# EAGLE design adc (EAGLE 9.6.2)
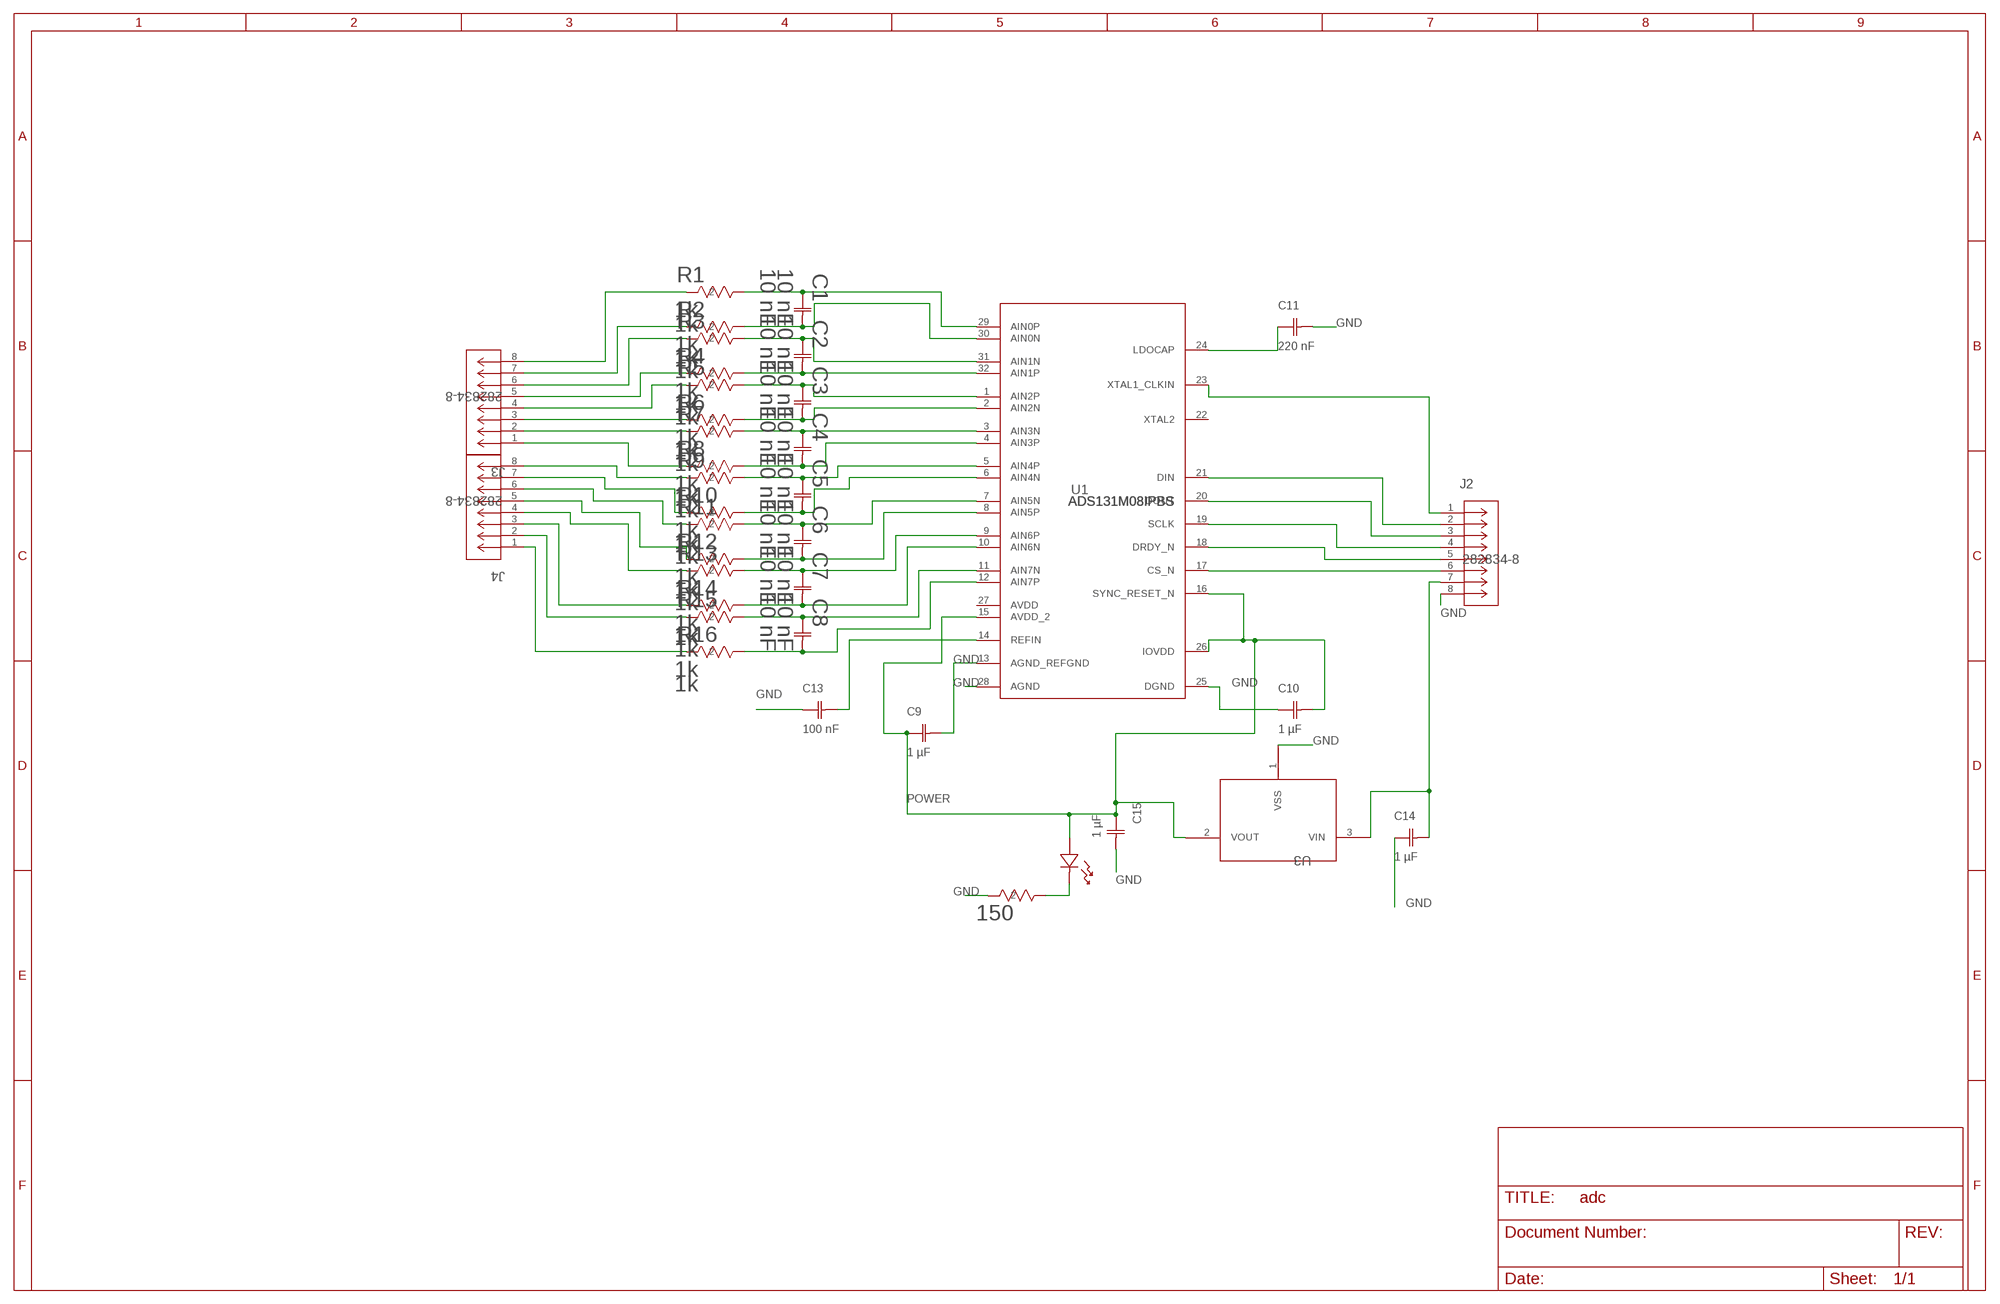
[diagram p0: schematic, sheet 1]

## Parts
C1  10 nF  C0805C103K5RACAUTO  [CAPC220145_88N_KEM]
C2  10 nF  C0805C103K5RACAUTO  [CAPC220145_88N_KEM]
C3  10 nF  C0805C103K5RACAUTO  [CAPC220145_88N_KEM]
C4  10 nF  C0805C103K5RACAUTO  [CAPC220145_88N_KEM]
C5  10 nF  C0805C103K5RACAUTO  [CAPC220145_88N_KEM]
C6  10 nF  C0805C103K5RACAUTO  [CAPC220145_88N_KEM]
C7  10 nF  C0805C103K5RACAUTO  [CAPC220145_88N_KEM]
C8  10 nF  C0805C103K5RACAUTO  [CAPC220145_88N_KEM]
C9  1 µF  C0805C105K5RACTU  [CAPC220145_140N_KEM]
C10  1 µF  C0805C105K5RACTU  [CAPC220145_140N_KEM]
C11  220 nF  C0805C224K5RACAUTO  [CAPC220145_100N_KEM]
C13  100 nF  C0805C104K5RACTU  [CAPC220145_88N_KEM]
C14  1 µF  C0805C105K5RACTU  [CAPC220145_140N_KEM]
C15  1 µF  C0805C105K5RACTU  [CAPC220145_140N_KEM]
J2  282834-8  [CONN_282834-8_TEC]
J3  282834-8  [CONN_282834-8_TEC]
J4  282834-8  [CONN_282834-8_TEC]
LED1  LTST-C190KFKT  [LED_LSTS-C190_LTO]
R1  1k  RC0402JR-071KLRC0402N_YAG-M  [RC0402N_YAG-M]
R2  1k  RC0402JR-071KLRC0402N_YAG-M  [RC0402N_YAG-M]
R3  1k  RC0402JR-071KLRC0402N_YAG-M  [RC0402N_YAG-M]
R4  1k  RC0402JR-071KLRC0402N_YAG-M  [RC0402N_YAG-M]
R5  1k  RC0402JR-071KLRC0402N_YAG-M  [RC0402N_YAG-M]
R6  1k  RC0402JR-071KLRC0402N_YAG-M  [RC0402N_YAG-M]
R7  1k  RC0402JR-071KLRC0402N_YAG-M  [RC0402N_YAG-M]
R8  1k  RC0402JR-071KLRC0402N_YAG-M  [RC0402N_YAG-M]
R9  1k  RC0402JR-071KLRC0402N_YAG-M  [RC0402N_YAG-M]
R10  1k  RC0402JR-071KLRC0402N_YAG-M  [RC0402N_YAG-M]
R11  1k  RC0402JR-071KLRC0402N_YAG-M  [RC0402N_YAG-M]
R12  1k  RC0402JR-071KLRC0402N_YAG-M  [RC0402N_YAG-M]
R13  1k  RC0402JR-071KLRC0402N_YAG-M  [RC0402N_YAG-M]
R14  1k  RC0402JR-071KLRC0402N_YAG-M  [RC0402N_YAG-M]
R15  1k  RC0402JR-071KLRC0402N_YAG-M  [RC0402N_YAG-M]
R16  1k  RC0402JR-071KLRC0402N_YAG-M  [RC0402N_YAG-M]
R18  150  RC0402JR-07150RLRC0402N_YAG-M  [RC0402N_YAG-M]
U1  ADS131M08IPBS  [PBS0032A_N]
U3  XC6206P332MR-GSOT-23_TOR-L  [SOT-23_TOR-L]

## Nets
GND: C9.2 C10.1 C11.2 C13.1 C14.1 C15.2 J2.8 R18.2 U1.13(AGND_REFGND) U1.25(DGND) U1.28(AGND) U3.1(VSS)
N$1: C1.1 R1.1 U1.29(AIN0P)
N$2: C1.2 R2.1 U1.30(AIN0N)
N$3: C2.1 R3.1 U1.31(AIN1N)
N$4: C2.2 R4.1 U1.32(AIN1P)
N$5: C3.1 R5.1 U1.1(AIN2P)
N$6: C3.2 R6.1 U1.2(AIN2N)
N$7: C4.1 R7.1 U1.3(AIN3N)
N$8: C4.2 R8.1 U1.4(AIN3P)
N$9: C5.1 R9.1 U1.5(AIN4P)
N$10: C5.2 R10.1 U1.6(AIN4N)
N$11: C6.1 R11.1 U1.7(AIN5N)
N$12: C6.2 R12.1 U1.8(AIN5P)
N$13: C7.1 R13.1 U1.9(AIN6P)
N$14: C7.2 R14.1 U1.10(AIN6N)
N$15: C8.1 R15.1 U1.11(AIN7N)
N$16: C8.2 R16.1 U1.12(AIN7P)
N$17: C11.1 U1.24(LDOCAP)
N$18: J2.1 U1.23(XTAL1_CLKIN)
N$20: J3.8 R1.2
N$21: J3.7 R2.2
N$22: J3.6 R3.2
N$23: J3.5 R4.2
N$24: J3.4 R5.2
N$25: J3.3 R6.2
N$26: J3.2 R7.2
N$27: J3.1 R8.2
N$28: J4.8 R9.2
N$29: J4.7 R10.2
N$30: J4.6 R11.2
N$31: J4.5 R12.2
N$32: J4.4 R13.2
N$33: J4.3 R14.2
N$34: J4.2 R15.2
N$35: J4.1 R16.2
N$36: J2.4 U1.19(SCLK)
N$37: J2.6 U1.17(CS_N)
N$38: J2.5 U1.18(DRDY_N)
N$39: J2.3 U1.20(DOUT)
N$40: J2.2 U1.21(DIN)
N$41: C13.2 U1.14(REFIN)
N$46: LED1.1(CATHODE) R18.1
N$52: C14.2 J2.7 U3.3(VIN)
POWER: C9.1 C10.2 C15.1 LED1.2(ANODE) U1.15(AVDD_2) U1.16(SYNC_RESET_N) U1.26(IOVDD) U3.2(VOUT)
Unconnected: U1.22(XTAL2)

## Power pins joined to a net without a drawn wire
AVDD: U1.27(AVDD)

## Library data of the parts
C1-C8 = C3225X7R1N106M250AC:C0805C103K5RACAUTO; COPYRIGHT: Copyright (C) 2025 Ultra Librarian. All rights reserved.; MANUFACTURER_PART_NUMBER: C0805C103K5RACAUTO; MFR_NAME: Kemet
C9 C10 C14 C15 = C3225X7R1N106M250AC:C0805C105K5RACTU; COPYRIGHT: Copyright (C) 2025 Ultra Librarian. All rights reserved.; MANUFACTURER_PART_NUMBER: C0805C105K5RACTU; MFR_NAME: Kemet
C11 = C3225X7R1N106M250AC:C0805C224K5RACAUTO; COPYRIGHT: Copyright (C) 2025 Ultra Librarian. All rights reserved.; MANUFACTURER_PART_NUMBER: C0805C224K5RACAUTO; MFR_NAME: Kemet
C13 = C3225X7R1N106M250AC:C0805C104K5RACTU; COPYRIGHT: Copyright (C) 2025 Ultra Librarian. All rights reserved.; MANUFACTURER_PART_NUMBER: C0805C104K5RACTU; MFR_NAME: Kemet
J2-J4 = burakkbaltaa:282834-8; COPYRIGHT: Copyright (C) 2025 Ultra Librarian. All rights reserved.; MANUFACTURER_PART_NUMBER: 282834-8; MFR_NAME: TE Connectivity
LED1 = burakkbaltaa:LTST-C190KFKT; COPYRIGHT: Copyright (C) 2025 Ultra Librarian. All rights reserved.; MANUFACTURER_PART_NUMBER: LTST-C190KFKT; MFR_NAME: LITE-ON; TYPE: LED Indication
R1-R16 = burakkbaltaa:RC0402JR-071KL; COPYRIGHT: Copyright (C) 2025 Ultra Librarian. All rights reserved.; MANUFACTURER_PART_NUMBER: RC0402JR-071KL; MFR_NAME: Yageo
R18 = burakkbaltaa:RC0402JR-07150RL; COPYRIGHT: Copyright (C) 2025 Ultra Librarian. All rights reserved.; MANUFACTURER_PART_NUMBER: RC0402JR-07150RL; MFR_NAME: Yageo
U1 = burakkbaltaa:ADS131M08IPBS; COPYRIGHT: Copyright (C) 2025 Ultra Librarian. All rights reserved.; MANUFACTURER_PART_NUMBER: ADS131M08IPBS; MFR_NAME: Texas Instruments; REFDES: RefDes; TYPE: TYPE
U3 = burakkbaltaa:XC6206P332MR-G; COPYRIGHT: Copyright (C) 2025 Ultra Librarian. All rights reserved.; MANUFACTURER_PART_NUMBER: XC6206P332MR-G; MFR_NAME: Torex Semiconductor

## Board
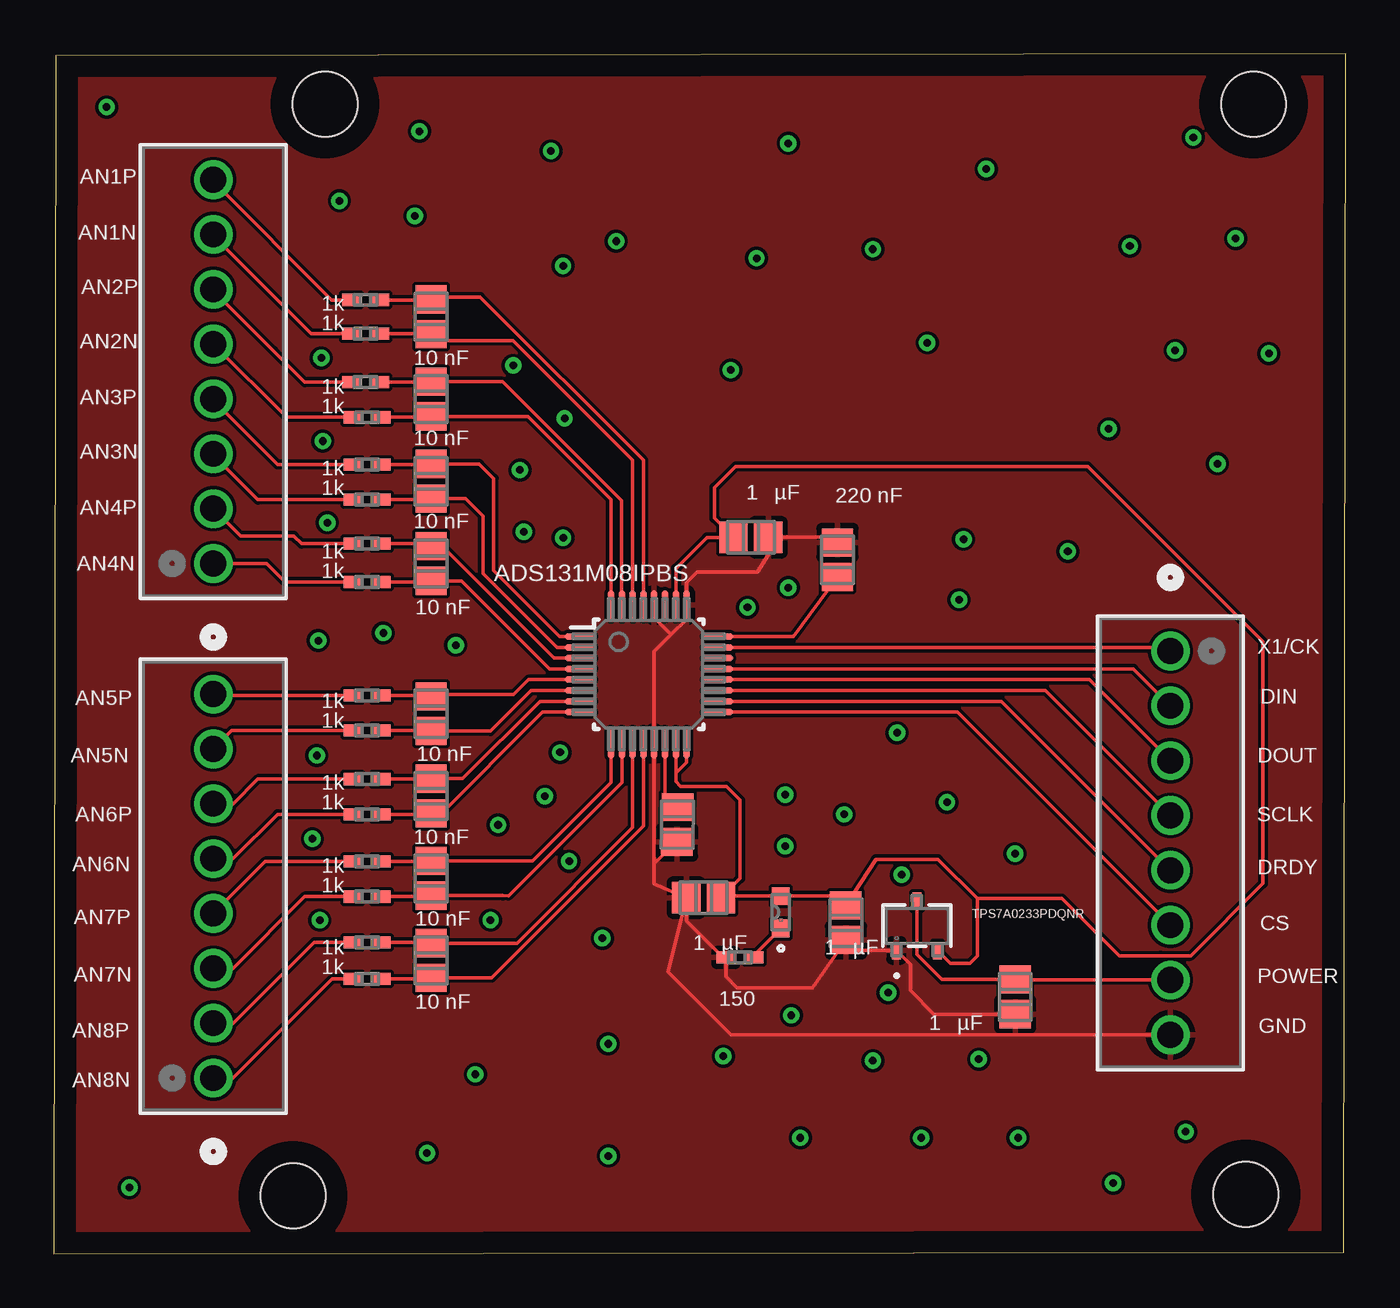
[diagram p1: board, top side]
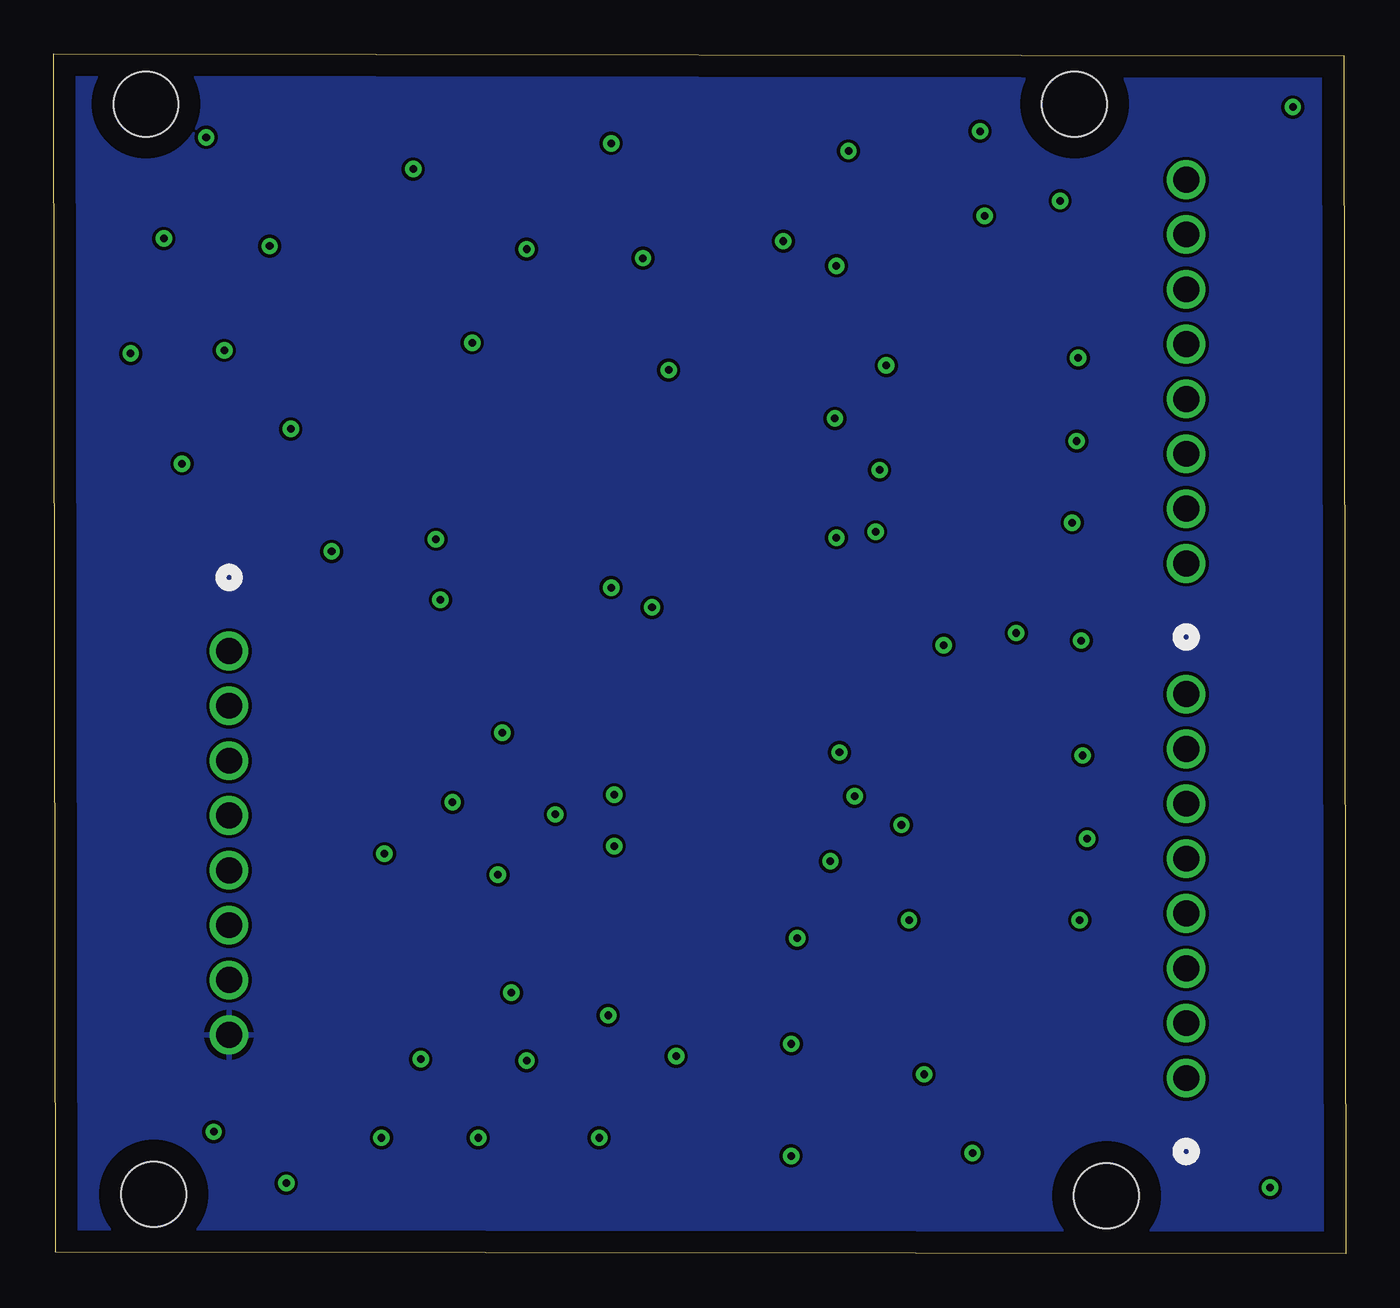
[diagram p2: board, bottom side, seen from below]

Size 59.82 x 55.57 mm. Coordinates in mm from the lower left corner, seen from the top.
Outline: 0,0 59.75,0.07 59.82,55.57 0.07,55.5 0,0
Copper layers (1*16): Top 0.035mm / dielectric 1.5mm / Bottom 0.035mm
Design rules "default *": minimum track width 6mil, minimum drill 0.35mm, track to track 6mil, track to pad 6mil, pad to pad 6mil, via to via 6mil, smd to smd 6mil, copper to edge 40mil, drill to drill 6mil, minimum pad ring 10mil, minimum via ring 8mil, stop-mask expansion 4mil, vias tented up to drill 0mil, thermal gap 10mil
Holes 3 mm at 55.56,53.25 55.2,2.75 12.55,53.25 11.07,2.68

### Footprints (pad centres in the part's own frame; a part is rotated, then mirrored left to right if it is on the bottom)
CAPC220145_88N_KEM = smd 1.306 x 1.45: 1 -0.803,0; 2 0.803,0
CAPC220145_140N_KEM = smd 1.306 x 1.45: 1 -0.803,0; 2 0.803,0
CAPC220145_100N_KEM = smd 1.306 x 1.45: 1 -0.803,0; 2 0.803,0
CONN_282834-8_TEC = drill 1.194 pad 1.702: 1 0,0; 2 2.54,0; 3 5.08,0; 4 7.62,0; 5 10.16,0; 6 12.7,0; 7 15.24,0; 8 17.78,0
LED_LSTS-C190_LTO = smd 0.813 x 0.813: 1 -0.75,0; 2 0.75,0
RC0402N_YAG-M = smd 0.864 x 0.559: 1 -0.66,0; 2 0.66,0
PBS0032A_N = smd 1.4 x 0.3: 1 -3.2,1.75; 2 -3.2,1.25; 3 -3.2,0.75; 4 -3.2,0.25; 5 -3.2,-0.25; 6 -3.2,-0.75; 7 -3.2,-1.25; 8 -3.2,-1.75; 17 3.2,-1.75; 18 3.2,-1.25; 19 3.2,-0.75; 20 3.2,-0.25; 21 3.2,0.25; 22 3.2,0.75; 23 3.2,1.25; 24 3.2,1.75 | smd 0.3 x 1.4: 9 -1.75,-3.2; 10 -1.25,-3.2; 11 -0.75,-3.2; 12 -0.25,-3.2; 13 0.25,-3.2; 14 0.75,-3.2; 15 1.25,-3.2; 16 1.75,-3.2; 25 1.75,3.2; 26 1.25,3.2; 27 0.75,3.2; 28 0.25,3.2; 29 -0.25,3.2; 30 -0.75,3.2; 31 -1.25,3.2; 32 -1.75,3.2
SOT-23_TOR-L = smd 0.432 x 0.813: 1 -0.95,-1.143; 2 0.95,-1.143; 3 0,1.143

### Placement (x,y rotation side)
C1  17.47,43.4 270 top
C2  17.47,39.59 270 top
C3  17.47,35.78 270 top
C4  17.47,31.97 270 top
C5  17.47,25.01 270 top
C6  17.47,21.2 270 top
C7  17.47,17.39 270 top
C8  17.47,13.58 270 top
C9  30.09,16.49 180 top
C10  32.28,33.18 180 top
C11  36.29,32.14 90 top
C13  28.87,19.88 89.3 top
C14  44.52,11.9 90 top
C15  36.68,15.33 270.3 top
J2  51.71,27.92 270 top
J3  7.38,31.97 90 top
J4  7.38,8.14 90 top
LED1  33.67,15.82 90 top
R1  14.43,44.18 180 top
R2  14.43,42.62 180 top
R3  14.43,40.37 180 top
R4  14.5,38.74 180 top
R5  14.5,36.56 180 top
R6  14.5,34.93 180 top
R7  14.5,32.89 180 top
R8  14.5,31.12 180 top
R9  14.5,25.86 180 top
R10  14.5,24.23 180 top
R11  14.5,21.98 180 top
R12  14.5,20.35 180 top
R13  14.5,18.17 180 top
R14  14.5,16.54 180 top
R15  14.5,14.43 180 top
R16  14.5,12.73 180 top
R18  31.78,13.72 180 top
U1  27.55,26.84 0 top
U3  39.97,15.19 0 top

### Tracks (layer width: path | path; a pad name or v marks a point on that pad's centre or on a via)
GND
  Top 0.152: U1.28 27.85,29.99 27.85,29.4 28.58,28.67 | 28.58,28.67 29.29,29.38 29.3,29.38 U1.25 29.3,31.08 29.79,31.57 32.58,31.57 33.08,32.4 C10.1 33.93,33.2 36.26,33.2 C11.2 | 28.58,28.67 27.8,27.89 U1.13 27.8,18.08 | 27.8,18.08 27.8,17.13 C9.2 | C9.2 28.44,13.05 31.35,10.14 J2.8 | C13.1 27.8,18.08 | 36.69,14.05 C15.2 | C15.2 35.14,12.32 31.64,12.32 31.12,12.84 31.12,13.58 | 31.12,13.58 R18.2 | C15.2 37.06,14.05 U3.1 39.67,13.4 39.67,12.19 40.76,11.1 C14.1 | C9.2 29.29,15.41 31.12,13.58
  pour Top: 59.63,55.37 0.18,55.37 0.18,0.14 59.63,0.14
  pour Bottom: 0.2,55.37 0.2,0.13 59.66,0.13 59.66,55.37
N$1
  Top 0.152: C1.1 17.47,44.31 19.74,44.31 27.3,36.75 U1.29 | C1.1 17.47,44.14 | C1.1 17.45,44.18 R1.1
N$2
  Top 0.152: C1.2 17.4,42.3 21.26,42.3 26.8,36.76 U1.30 | C1.2 17.47,42.4 | C1.2 17.45,42.62 R2.1
N$3
  Top 0.152: U1.31 26.28,30.06 26.28,34.89 20.78,40.39 C2.1 17.45,40.37 R3.1
N$4
  Top 0.152: U1.32 25.8,34.94 21.96,38.78 C2.2 17.42,38.74 R4.1
N$5
  Top 0.152: U1.1 23.42,28.59 20.37,31.64 20.37,35.91 19.7,36.58 C3.1 17.45,36.56 R5.1
N$6
  Top 0.152: C3.2 17.48,34.77 | U1.2 23.29,28.09 19.88,31.5 19.88,34.16 19.06,34.98 C3.2 | C3.2 17.16,34.93 R6.1
N$7
  Top 0.152: C4.1 17.68,32.9 | U1.3 23.16,27.59 17.98,32.77 C4.1 | R7.1 17.35,32.89 C4.1
N$8
  Top 0.152: U1.4 23.17,27.09 | 23.17,27.09 | 23.17,27.09 22.96,27.09 18.88,31.17 C4.2 17.42,31.12 R8.1
N$9
  Top 0.152: U1.5 21.97,26.59 21.28,25.9 17.61,25.9 C5.1 17.13,25.86 R9.1
N$10
  Top 0.152: U1.6 22.1,26.09 20.22,24.21 C5.2 17.45,24.23 R10.1
N$11
  Top 0.152: 24.33,25.57 U1.7 22.51,25.59 18.92,22 C6.1 17.45,21.98 R11.1
N$12
  Top 0.152: U1.8 22.64,25.09 17.72,20.17 C6.2 17.42,20.35 R12.1
N$13
  Top 0.152: 17.83,18.19 C7.1 | U1.9 25.8,21.83 22.16,18.19 C7.1 | C7.1 17.45,18.17 R13.1
N$14
  Top 0.152: U1.10 26.3,21.83 21.05,16.58 20.78,16.59 C7.2 17.42,16.54 R14.1
N$15
  Top 0.152: U1.11 26.8,19.74 21.44,14.38 C8.1 | 17.62,14.38 C8.1 | C8.1 17.09,14.43 R15.1
N$16
  Top 0.152: U1.12 27.3,19.81 20.27,12.78 C8.2 | 17.77,12.78 C8.2 | R16.1 17.42,12.73 C8.2
N$17
  Top 0.152: U1.24 34.25,28.59 C11.1
N$18
  Top 0.152: U1.23 51.54,28.09 J2.1
N$19  (via drill 0.35)
  other vias: 22.74,21.19
N$20
  Top 0.152: R1.2 12.87,44.18 7.38,49.67 J3.8
N$21
  Top 0.152: R2.2 11.91,42.62 7.38,47.15 J3.7
N$22
  Top 0.152: R3.2 11.61,40.37 10.15,41.83 10.15,41.84 7.38,44.61 J3.6
N$23
  Top 0.152: R4.2 10.77,38.74 J3.5
N$24
  Top 0.152: R5.2 10.35,36.56 7.38,39.53 J3.4
N$25
  Top 0.152: R6.2 9.44,34.93 7.38,36.99 J3.3
N$26
  Top 0.152: R7.2 11.47,32.89 11.11,33.25 8.64,33.25 J3.2
N$27
  Top 0.152: R8.2 10.7,31.12 9.85,31.97 J3.1
N$28
  Top 0.152: R9.2 7.44,25.86 J4.8
N$29
  Top 0.152: R10.2 8.23,24.23 J4.7
N$30
  Top 0.152: R11.2 9.44,21.98 8.3,20.84 J4.6
N$31
  Top 0.152: R12.2 10.35,20.35 8.3,18.3 J4.5
N$32
  Top 0.152: R13.2 9.79,18.17 J4.4
N$33
  Top 0.152: R14.2 11.62,16.54 8.3,13.22 J4.3
N$34
  Top 0.152: R15.2 12.05,14.43 8.3,10.68 J4.2
N$35
  Top 0.152: R16.2 12.89,12.73 8.3,8.14 J4.1
N$36
  Top 0.152: U1.19 45.92,26.09 J2.4
N$37
  Top 0.152: U1.17 41.84,25.09 J2.6
N$38
  Top 0.152: U1.18 43.88,25.59 J2.5
N$39
  Top 0.152: J2.3 47.96,26.59 U1.20
N$40
  Top 0.152: U1.21 50,27.09 J2.2
N$41
  Top 0.152: C13.2 28.3,21.19 U1.14
N$42  (via drill 0.35)
  other vias: 39.26,17.55
N$43  (via drill 0.35)
  other vias: 26.04,46.9
N$44  (via drill 0.35)
  other vias: 37.93,46.53
N$45  (via drill 0.35)
  other vias: 25.67,9.72
N$46
  Top 0.152: 32.47,13.75 R18.1 32.44,13.84 LED1.1
N$47  (via drill 0.35)
  other vias: 21.58,36.3
N$48  (via drill 0.35)
  other vias: 36.6,20.35
N$49  (via drill 0.35)
  other vias: 12.17,23.08
N$50  (via drill 0.35)
  other vias: 11.97,19.22
N$51  (via drill 0.35)
  other vias: 44.51,18.53
N$52
  Top 0.152: 44.25,12.53 C14.2 | U3.3 39.97,13.86 41.13,12.7 C14.2 | J2.7 44.57,12.68 C14.2
N$53  (via drill 0.35)
  other vias: 49.83,46.67
N$54  (via drill 0.35)
  other vias: 34.57,5.37
N$55  (via drill 0.35)
  other vias: 17.28,4.67
N$56  (via drill 0.35)
  other vias: 49.06,3.27
N$57  (via drill 0.35)
  other vias: 48.85,38.2
N$58  (via drill 0.35)
  other vias: 41.36,20.91
N$59  (via drill 0.35)
  other vias: 38.63,12.09
N$60  (via drill 0.35)
  other vias: 37.93,8.94
N$61  (via drill 0.35)
  other vias: 42.83,9.01
N$62  (via drill 0.35)
  other vias: 31.35,40.93
N$63  (via drill 0.35)
  other vias: 42.13,33.09
N$64  (via drill 0.35)
  other vias: 16.72,48.07
N$65  (via drill 0.35)
  other vias: 56.27,41.7
N$66  (via drill 0.35)
  other vias: 39.05,24.13
N$67  (via drill 0.35)
  other vias: 12.31,15.45
N$70  (via drill 0.35)
  other vias: 25.68,4.53
N$71  (via drill 0.35)
  other vias: 40.45,42.19
N$72  (via drill 0.35)
  other vias: 15.25,28.75
N$73  (via drill 0.35)
  other vias: 23.58,33.16
N$74  (via drill 0.35)
  other vias: 19.52,8.31
N$76  (via drill 0.35)
  other vias: 43.18,50.24
N$79  (via drill 0.35)
  other vias: 44.65,5.37
N$80  (via drill 0.35)
  other vias: 40.17,5.37
N$81  (via drill 0.35)
  other vias: 34.15,11.04
N$82  (via drill 0.35)
  other vias: 31,9.15
N$83  (via drill 0.35)
  other vias: 32.54,46.11
N$84  (via drill 0.35)
  other vias: 23.02,51.08
N$85  (via drill 0.35)
  other vias: 34.01,51.43
N$86  (via drill 0.35)
  other vias: 52.77,51.71
N$87  (via drill 0.35)
  other vias: 54.73,47.02
N$88  (via drill 0.35)
  other vias: 51.93,41.84
N$89  (via drill 0.35)
  other vias: 53.89,36.59
N$90  (via drill 0.35)
  other vias: 46.96,32.53
N$91  (via drill 0.35)
  other vias: 41.92,30.29
N$92  (via drill 0.35)
  other vias: 25.4,14.61
N$93  (via drill 0.35)
  other vias: 20.57,19.86
N$94  (via drill 0.35)
  other vias: 23.44,23.22
N$95  (via drill 0.35)
  other vias: 12.24,28.4
N$96  (via drill 0.35)
  other vias: 18.61,28.19
N$97  (via drill 0.35)
  other vias: 21.76,33.44
N$100  (via drill 0.35)
  other vias: 2.44,53.11
N$102  (via drill 0.35)
  other vias: 3.49,3.06
N$103  (via drill 0.35)
  other vias: 12.66,33.86
N$104  (via drill 0.35)
  other vias: 12.45,37.64
N$105  (via drill 0.35)
  other vias: 12.38,41.49
N$106  (via drill 0.35)
  other vias: 13.22,48.77
N$107  (via drill 0.35)
  other vias: 16.93,51.99
N$108  (via drill 0.35)
  other vias: 23.58,45.76
N$109  (via drill 0.35)
  other vias: 23.65,38.69
N$110  (via drill 0.35)
  other vias: 23.86,18.18
N$111  (via drill 0.35)
  other vias: 20.22,15.45
N$112  (via drill 0.35)
  other vias: 21.27,41.14
N$113  (via drill 0.35)
  other vias: 34.01,30.85
N$114  (via drill 0.35)
  other vias: 32.12,29.94
N$115  (via drill 0.35)
  other vias: 33.87,18.88
N$116  (via drill 0.35)
  other vias: 33.87,21.26
N$117  (via drill 0.35)
  other vias: 52.42,5.65
POWER
  Top 0.152: U1.15 28.8,22.26 | 28.8,22.26 28.8,21.87 29.02,21.65 31.14,21.65 31.78,21.01 31.78,17.38 C9.1 30.97,16.57 LED1.2 36.24,16.57 C15.1 38.06,18.27 40.95,18.27 42.77,16.45 | U1.26 28.8,31.74 30.24,33.18 C10.2 30.59,34.06 30.59,35.49 31.57,36.47 47.88,36.47 56,28.35 56,17.15 52.65,13.8 51.24,13.8 51.23,13.79 49.35,13.79 46.69,16.45 42.77,16.45 | U3.2 41.53,13.44 42.42,13.44 42.77,13.79 42.77,16.45 | U1.16 29.3,22.76 28.8,22.26

### Text on the board
tNames: AN1P | AN1N | AN2P | 1k | 1k | AN2N | 10 nF | AN3P | 1k | 1k | 10 nF | AN3N | 1k | 1k | AN4P | 1 µF | 220 nF | 10 nF | 1k | AN4N | 1k | ADS131M08IPBS | 10 nF | X1/CK | AN5P | 1k | DIN | 1k | AN5N | 10 nF | DOUT | 1k | 1k | AN6P | SCLK | 10 nF | AN6N | 1k | DRDY | 1k | AN7P | 10 nF | CS | 1k | 1 µF | 1 µF | AN7N | 1k | TPS7A0233PDQNR | POWER | 10 nF | 150 | 1 µF | GND | AN8P | AN8N